# EasyEDA Pro project YanXi_Project.eprj, board PayloadBoard
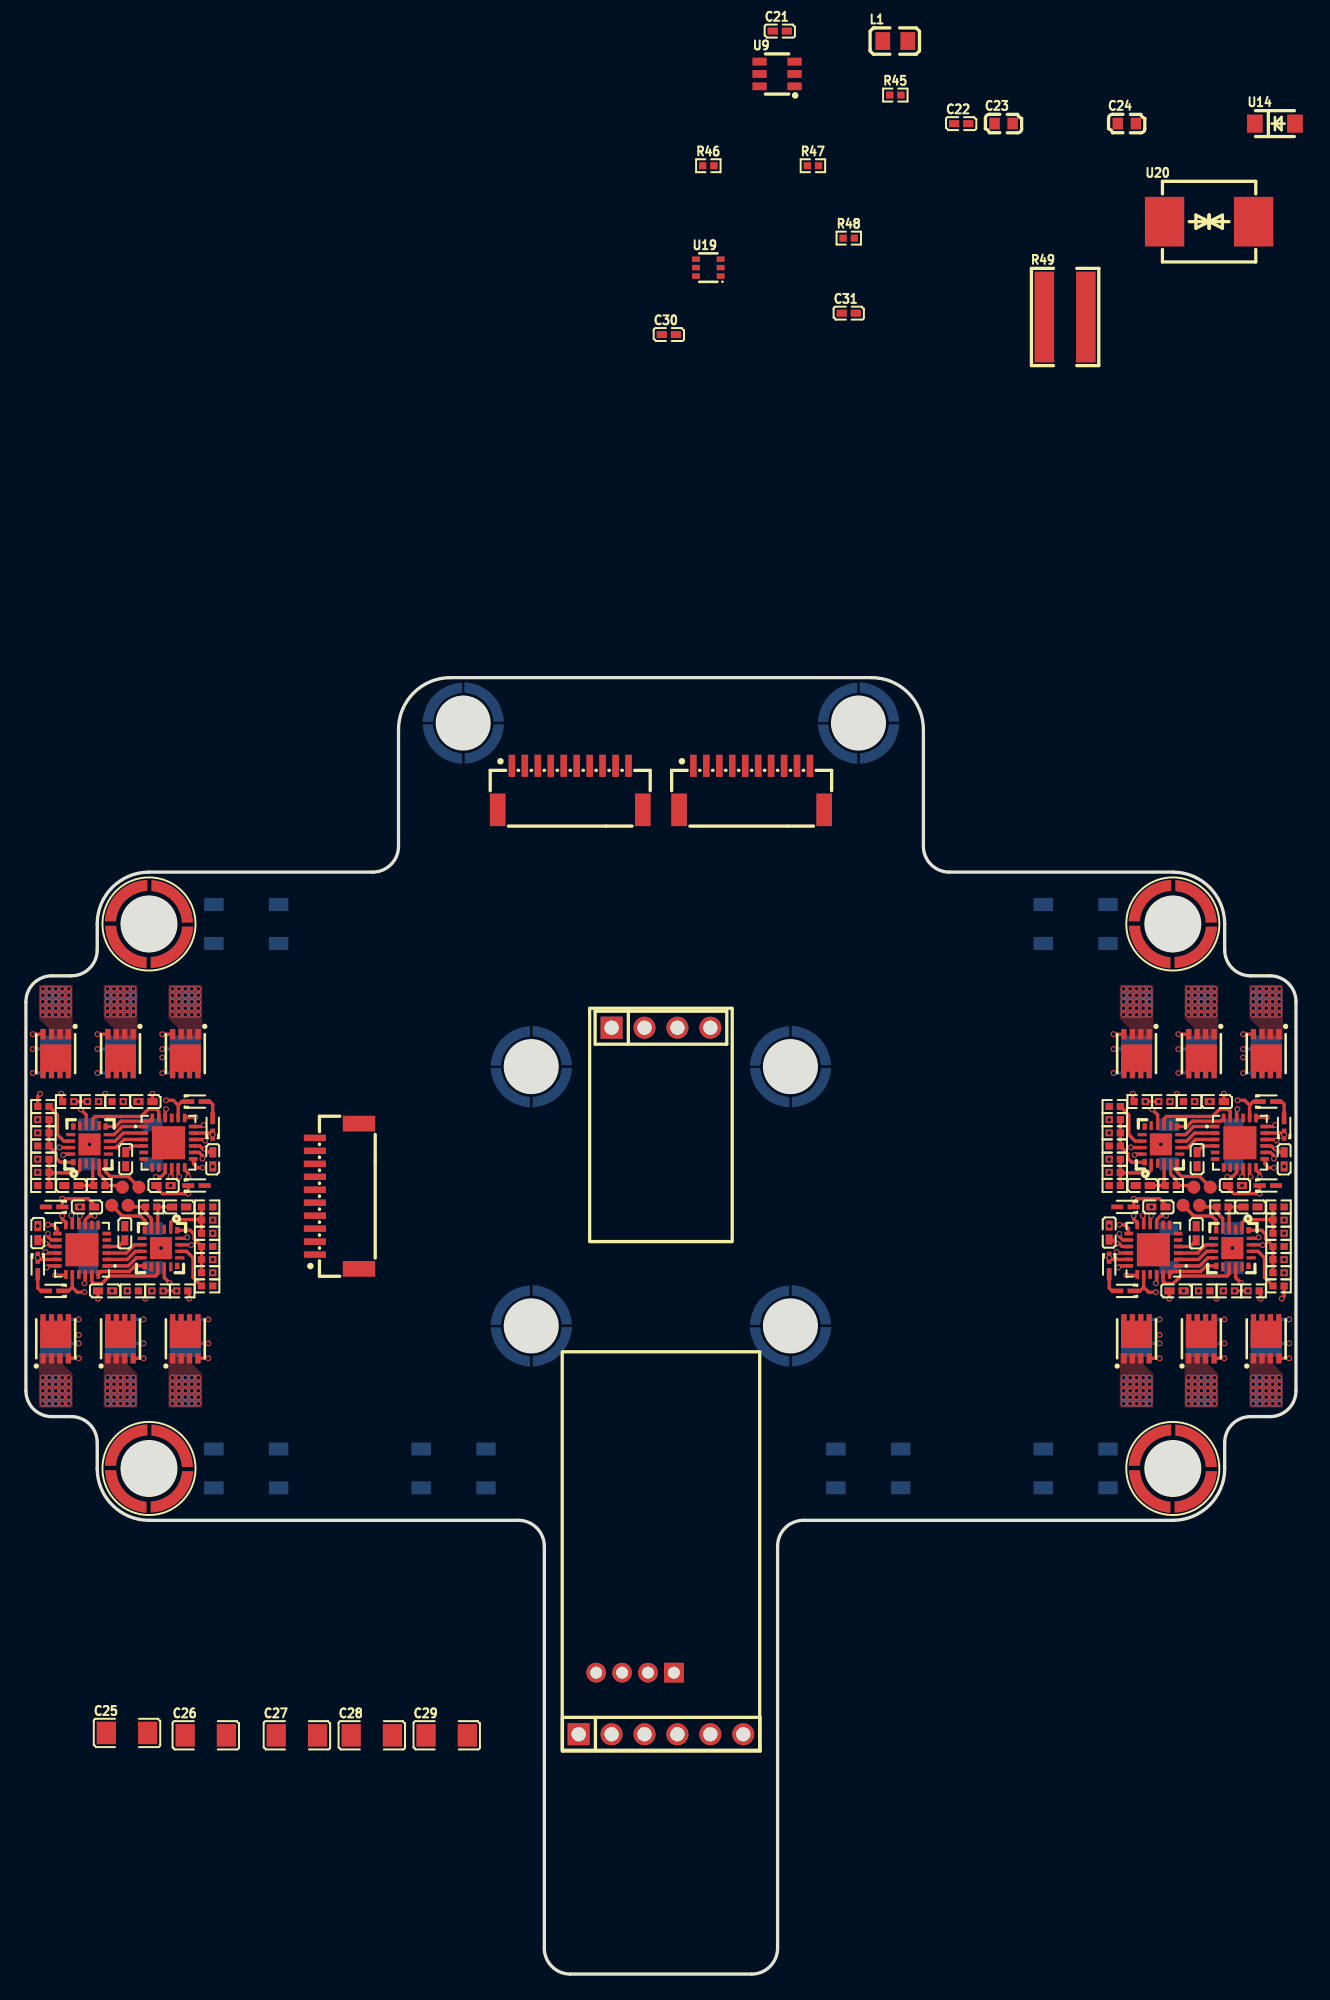
[diagram p5: board, top side]
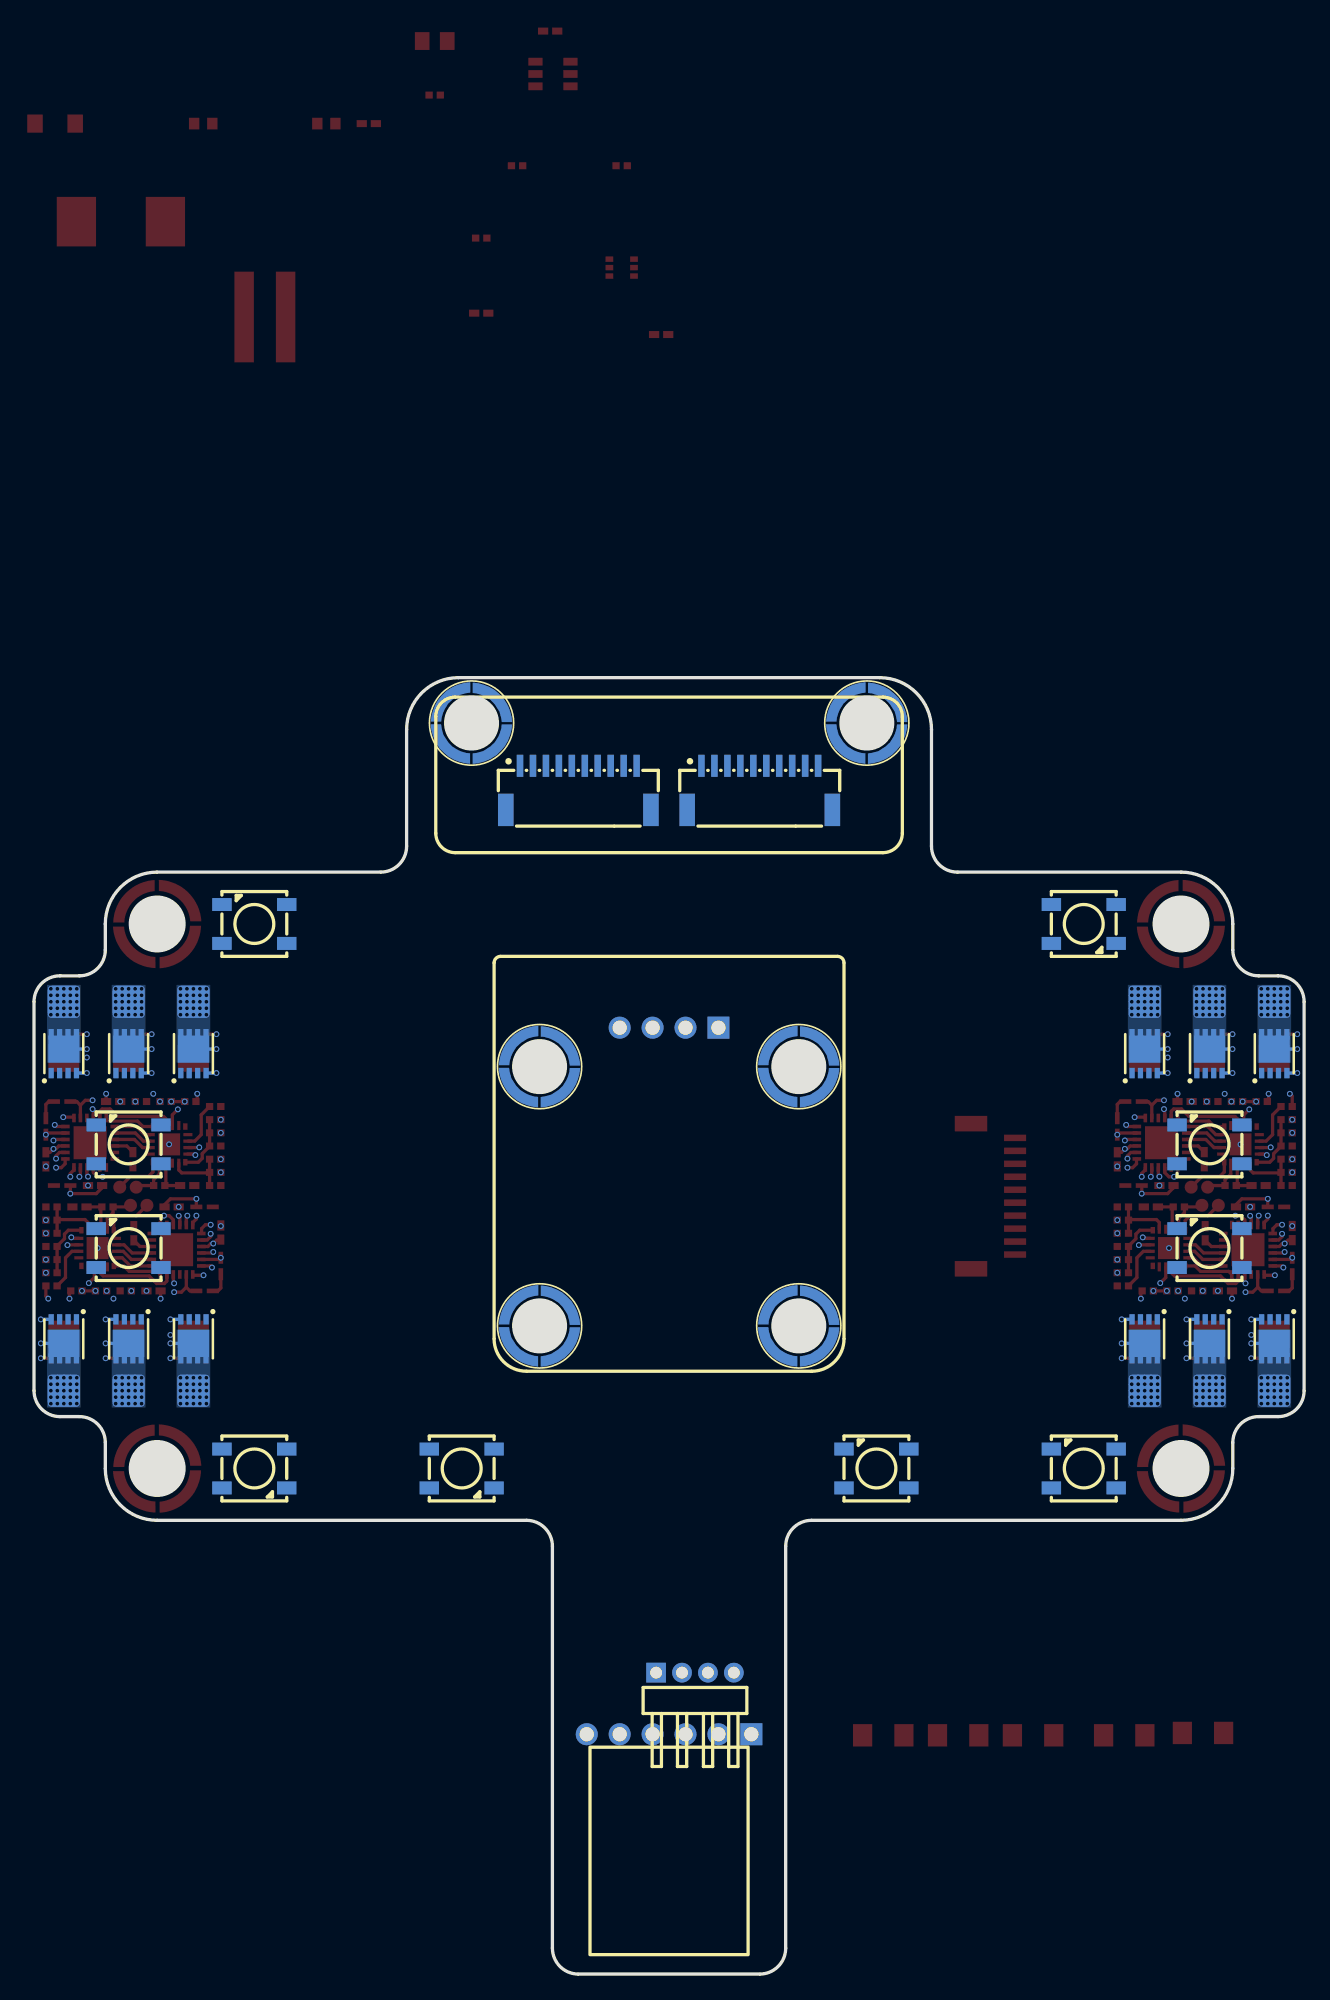
[diagram p6: board, bottom side, seen from below]

Outline 98 x 100 mm; copper layers: Top Layer, Inner1, Inner2, Bottom Layer. Coordinates in mm from the lower left corner of the outline.
Outline path: 0,75 0,45 arc(0.59,43.59) 2,43 3.5,43 arc(4.91,42.41) 5.5,41 5.5,39 arc(6.67,36.17) 9.5,35 38,35 arc(39.41,34.41) 40,33 40,2 arc(40.59,0.59) 42,0 56,0 arc(57.41,0.59) 58,2 58,33 arc(58.59,34.41) 60,35 88.5,35 arc(91.33,36.17) 92.5,39 92.5,41 arc(93.09,42.41) 94.5,43 96,43 arc(97.41,43.59) 98,45 98,75 arc(97.41,76.41) 96,77 94.5,77 arc(93.09,77.59) 92.5,79 92.5,81 arc(91.33,83.83) 88.5,85 71.25,85 arc(69.84,85.59) 69.25,87 69.25,96 arc(68.08,98.83) 65.25,100 32.75,100 arc(29.92,98.83) 28.75,96 28.75,87 arc(28.16,85.59) 26.75,85 9.5,85 arc(6.67,83.83) 5.5,81 5.5,79 arc(4.91,77.59) 3.5,77 2,77 arc(0.59,76.41) 0,75
Stack: Top Layer 0.035mm / Dielectric1 0.48mm PP er 4.5 / Inner1 0.035mm / Dielectric2 0.48mm FR4 er 4.5 / Inner2 0.035mm / Dielectric3 0.48mm PP er 4.5 / Bottom Layer 0.035mm

## Design rules (mm)
template: 自定义配置
spacing copperThickness1oz (default): track to track 0.102, other pairs 0.152 to 0.3
spacing copperThickness2oz: track to track 0.203, other pairs 0.152 to 0.3
spacing copperThicknessInner0.5oz: track to track 0.089, other pairs 0.152 to 0.3
track width copperThickness1oz (default): min 0.102, default 0.254, max 2.54
track width copperThickness2oz: min 0.203, default 0.254, max 2.54
track width copperThickness0.5oz: min 0.089, default 0.254, max 2.54
differential pair differentialPair (default): width min 0.127, default 0.254, max 2.54; gap min 0.152, default 0.152
via viaSize (default): diameter min 0.3, default 0.45, max 10; hole min 0.2, default 0.3, max 6.3

## Placement (name value [footprint] x y rotation side)
C1  1uF  [C0402]  91.89 67.3 180 top
C2  1uF  [C0402]  97.09 62.84 270 top
C3  100nF  [C0402_NEW]  86.18 60.83 180 top
C4  100nF  [C0402_NEW]  90.37 62.86 90 top
C5  1uF  [C0402]  93.29 60.83 180 top
C6  1uF  [C0402]  6.11 52.7 0 top
C7  1uF  [C0402]  0.92 57.16 90 top
C8  100nF  [C0402_NEW]  11.82 59.17 0 top
C9  100nF  [C0402_NEW]  7.63 57.14 270 top
C10  1uF  [C0402]  4.71 59.17 0 top
C11  1uF  [C0402]  9.22 67.3 180 top
C12  1uF  [C0402]  14.41 62.84 270 top
C13  100nF  [C0402_NEW]  3.51 60.83 180 top
C14  100nF  [C0402_NEW]  7.7 62.86 90 top
C15  1uF  [C0402]  10.62 60.83 180 top
C16  1uF  [C0402]  88.78 52.7 0 top
C17  1uF  [C0402]  83.59 57.2 90 top
C18  100nF  [C0402_NEW]  94.49 59.17 0 top
C19  100nF  [C0402_NEW]  90.3 57.14 270 top
C20  1uF  [C0402]  87.38 59.17 0 top
C21  100nF  [C0402_NEW]  58.17 149.88 0 top
C22  100nF  [C0402_NEW]  72.16 142.74 0 top
C23  4.7uF  [C0603]  75.44 142.74 0 top
C24  10uF  [C0603]  84.95 142.74 0 top
C25  10uF  [C1206]  7.8 18.6 0 top
C26  10uF  [C1206]  13.88 18.42 0 top
C27  10uF  [C1206]  20.91 18.42 0 top
C28  10uF  [C1206]  26.69 18.42 0 top
C29  10uF  [C1206]  32.47 18.42 0 top
C30  100nF  [C0402_NEW]  49.61 126.47 0 top
C31  1nF  [C0402]  63.49 128.12 0 top
D1  1N4148WT T4  [SOD-523_L1.2-W0.8-LS1.6-RD]  95.83 67.3 0 top
D2  1N4148WT T4  [SOD-523_L1.2-W0.8-LS1.6-RD]  97.09 65.38 90 top
D3  1N4148WT T4  [SOD-523_L1.2-W0.8-LS1.6-RD]  95.83 60.83 0 top
D4  1N4148WT T4  [SOD-523_L1.2-W0.8-LS1.6-RD]  2.17 52.7 180 top
D5  1N4148WT T4  [SOD-523_L1.2-W0.8-LS1.6-RD]  0.92 54.62 270 top
D6  1N4148WT T4  [SOD-523_L1.2-W0.8-LS1.6-RD]  2.17 59.17 180 top
D7  1N4148WT T4  [SOD-523_L1.2-W0.8-LS1.6-RD]  13.16 67.3 0 top
D8  1N4148WT T4  [SOD-523_L1.2-W0.8-LS1.6-RD]  14.41 65.38 90 top
D9  1N4148WT T4  [SOD-523_L1.2-W0.8-LS1.6-RD]  13.16 60.83 0 top
D10  1N4148WT T4  [SOD-523_L1.2-W0.8-LS1.6-RD]  84.84 52.7 180 top
D11  1N4148WT T4  [SOD-523_L1.2-W0.8-LS1.6-RD]  83.59 54.62 270 top
D12  1N4148WT T4  [SOD-523_L1.2-W0.8-LS1.6-RD]  84.84 59.17 180 top
D13  -  [端口]  95.7 75 180 bottom
D14  -  [端口]  90.7 75 180 bottom
D15  -  [端口]  85.7 75 180 bottom
D16  -  [端口]  12.3 75 180 bottom
D17  -  [端口]  7.3 75 180 bottom
D18  -  [端口]  2.3 75 180 bottom
D19  -  [端口]  2.3 45 180 bottom
D20  -  [端口]  7.3 45 180 bottom
D21  -  [端口]  12.3 45 180 bottom
D22  -  [端口]  85.7 45 180 bottom
D23  -  [端口]  90.7 45 180 bottom
D24  -  [端口]  95.7 45 180 bottom
H1  PZ254V-11-04P  [HDR-TH_4P-P2.54-V-M]  49 73 0 top
H2  PZ200-1-04-W  [HDR-TH_4P-P2.00-H-M-W7.2-N]  47 23.25 180 bottom
H3  PZ254V-11-06P  [HDR-TH_6P-P2.54-V-M]  49 18.5 0 top
L1  6.8uH  [L0805]  67.08 149.1 0 top
LED1  XL-5050RGBC-WS2812B  [LED-SMD_4P-L5.0-W5.0-BL_XL-5050RGBC]  17 81 270 bottom
LED2  XL-5050RGBC-WS2812B  [LED-SMD_4P-L5.0-W5.0-BL_XL-5050RGBC]  7.3 64 90 bottom
LED3  XL-5050RGBC-WS2812B  [LED-SMD_4P-L5.0-W5.0-BL_XL-5050RGBC]  7.3 56 90 bottom
LED4  XL-5050RGBC-WS2812B  [LED-SMD_4P-L5.0-W5.0-BL_XL-5050RGBC]  17 39 90 bottom
LED5  XL-5050RGBC-WS2812B  [LED-SMD_4P-L5.0-W5.0-BL_XL-5050RGBC]  33 39 90 bottom
LED6  XL-5050RGBC-WS2812B  [LED-SMD_4P-L5.0-W5.0-BL_XL-5050RGBC]  65 39 270 bottom
LED7  XL-5050RGBC-WS2812B  [LED-SMD_4P-L5.0-W5.0-BL_XL-5050RGBC]  81 39 270 bottom
LED8  XL-5050RGBC-WS2812B  [LED-SMD_4P-L5.0-W5.0-BL_XL-5050RGBC]  90.7 56 90 bottom
LED9  XL-5050RGBC-WS2812B  [LED-SMD_4P-L5.0-W5.0-BL_XL-5050RGBC]  90.7 64 90 bottom
LED10  XL-5050RGBC-WS2812B  [LED-SMD_4P-L5.0-W5.0-BL_XL-5050RGBC]  81 81 90 bottom
Q1  AON7544  [DFN-8_L3.0-W3.0-P0.65-BL]  95.7 71 180 top
Q2  AON7544  [DFN-8_L3.0-W3.0-P0.65-BL]  90.7 71 180 top
Q3  AON7544  [DFN-8_L3.0-W3.0-P0.65-BL]  85.7 71 180 top
Q4  AON7544  [DFN-8_L3.0-W3.0-P0.65-BL]  12.3 71 180 top
Q5  AON7544  [DFN-8_L3.0-W3.0-P0.65-BL]  7.3 71 180 top
Q6  AON7544  [DFN-8_L3.0-W3.0-P0.65-BL]  2.3 71 180 top
Q7  AON7544  [DFN-8_L3.0-W3.0-P0.65-BL]  95.7 71 180 bottom
Q8  AON7544  [DFN-8_L3.0-W3.0-P0.65-BL]  90.7 71 180 bottom
Q9  AON7544  [DFN-8_L3.0-W3.0-P0.65-BL]  85.7 71 180 bottom
Q10  AON7544  [DFN-8_L3.0-W3.0-P0.65-BL]  12.3 71 180 bottom
Q11  AON7544  [DFN-8_L3.0-W3.0-P0.65-BL]  7.3 71 180 bottom
Q12  AON7544  [DFN-8_L3.0-W3.0-P0.65-BL]  2.3 71 180 bottom
Q13  AON7544  [DFN-8_L3.0-W3.0-P0.65-BL]  2.3 49 0 top
Q14  AON7544  [DFN-8_L3.0-W3.0-P0.65-BL]  7.3 49 0 top
Q15  AON7544  [DFN-8_L3.0-W3.0-P0.65-BL]  12.3 49 0 top
Q16  AON7544  [DFN-8_L3.0-W3.0-P0.65-BL]  85.7 49 0 top
Q17  AON7544  [DFN-8_L3.0-W3.0-P0.65-BL]  90.7 49 0 top
Q18  AON7544  [DFN-8_L3.0-W3.0-P0.65-BL]  95.7 49 0 top
Q19  AON7544  [DFN-8_L3.0-W3.0-P0.65-BL]  2.3 49 0 bottom
Q20  AON7544  [DFN-8_L3.0-W3.0-P0.65-BL]  7.3 49 0 bottom
Q21  AON7544  [DFN-8_L3.0-W3.0-P0.65-BL]  12.3 49 0 bottom
Q22  AON7544  [DFN-8_L3.0-W3.0-P0.65-BL]  85.7 49 0 bottom
Q23  AON7544  [DFN-8_L3.0-W3.0-P0.65-BL]  90.7 49 0 bottom
Q24  AON7544  [DFN-8_L3.0-W3.0-P0.65-BL]  95.7 49 0 bottom
R1  10K  [R0402]  84.02 66.92 180 top
R2  47K  [R0402]  84.02 62.86 180 top
R3  47K  [R0402]  85.94 67.3 180 top
R4  47K  [R0402]  84.02 65.91 180 top
R5  10K  [R0402]  84.02 61.84 0 top
R6  10K  [R0402]  87.84 67.3 180 top
R7  1K  [R0402]  88.34 60.83 0 top
R8  10K  [R0402]  84.02 64.89 0 top
R9  4.7K  [R0402]  84.02 60.83 0 top
R10  4.7K  [R0402]  89.75 67.3 0 top
R11  4.7K  [R0402]  84.02 63.87 0 top
R12  10K  [R0402]  13.98 53.08 0 top
R13  47K  [R0402]  13.98 57.14 0 top
R14  47K  [R0402]  12.06 52.7 0 top
R15  47K  [R0402]  13.98 54.09 0 top
R16  10K  [R0402]  13.98 58.16 180 top
R17  10K  [R0402]  10.16 52.7 0 top
R18  1K  [R0402]  9.66 59.17 180 top
R19  10K  [R0402]  13.98 55.11 180 top
R20  4.7K  [R0402]  13.98 59.17 180 top
R21  4.7K  [R0402]  8.25 52.7 180 top
R22  4.7K  [R0402]  13.98 56.13 180 top
R23  10K  [R0402]  1.35 66.92 180 top
R24  47K  [R0402]  1.35 62.86 180 top
R25  47K  [R0402]  3.27 67.3 180 top
R26  47K  [R0402]  1.35 65.91 180 top
R27  10K  [R0402]  1.35 61.84 0 top
R28  10K  [R0402]  5.17 67.3 180 top
R29  1K  [R0402]  5.67 60.83 0 top
R30  10K  [R0402]  1.35 64.89 0 top
R31  4.7K  [R0402]  1.35 60.83 0 top
R32  4.7K  [R0402]  7.08 67.3 0 top
R33  4.7K  [R0402]  1.35 63.87 0 top
R34  10K  [R0402]  96.65 53.08 0 top
R35  47K  [R0402]  96.65 57.14 0 top
R36  47K  [R0402]  94.73 52.7 0 top
R37  47K  [R0402]  96.65 54.09 0 top
R38  10K  [R0402]  96.65 58.16 180 top
R39  10K  [R0402]  92.83 52.7 0 top
R40  1K  [R0402]  92.33 59.17 180 top
R41  10K  [R0402]  96.65 55.11 180 top
R42  4.7K  [R0402]  96.65 59.17 180 top
R43  4.7K  [R0402]  90.92 52.7 180 top
R44  4.7K  [R0402]  96.65 56.13 180 top
R45  100kΩ  [R0402]  67.08 144.94 0 top
R46  10K  [R0402]  52.66 139.49 0 top
R47  90.9kΩ  [R0402]  60.73 139.49 0 top
R48  56Ω  [R0402]  63.49 133.9 0 top
R49  10mΩ  [R1225]  80.19 127.82 0 top
U1  EFM8BB21F16G-C-QFN20R  [QFN-20_L3.0-W3.0-P0.50-BL-EP1.7_EFM8BB21F16G]  87.58 64 0 top
U2  FD6288Q  [QFN-24_L4.0-W4.0-P0.50-BL-EP2.6]  93.67 64.13 270 top
U3  EFM8BB21F16G-C-QFN20R  [QFN-20_L3.0-W3.0-P0.50-BL-EP1.7_EFM8BB21F16G]  10.42 56 180 top
U4  FD6288Q  [QFN-24_L4.0-W4.0-P0.50-BL-EP2.6]  4.33 55.87 90 top
U5  EFM8BB21F16G-C-QFN20R  [QFN-20_L3.0-W3.0-P0.50-BL-EP1.7_EFM8BB21F16G]  4.91 64 0 top
U6  FD6288Q  [QFN-24_L4.0-W4.0-P0.50-BL-EP2.6]  11 64.13 270 top
U7  EFM8BB21F16G-C-QFN20R  [QFN-20_L3.0-W3.0-P0.50-BL-EP1.7_EFM8BB21F16G]  93.09 56 180 top
U8  FD6288Q  [QFN-24_L4.0-W4.0-P0.50-BL-EP2.6]  87 55.87 90 top
U9  JW5026  [SOT-23-6_L2.9-W1.6-P0.95-LS2.8-BR]  57.96 146.56 0 top
U10  -  [烧录点]  90.12 60.7 0 top
U11  -  [烧录点]  7.89 59.3 180 top
U12  -  [烧录点]  7.44 60.7 0 top
U13  -  [烧录点]  90.56 59.3 0 top
U14  SMF8.0A  [SOD-123FL_L2.8-W1.8-LS3.6-RD]  96.38 142.74 0 top
U15  -  [烧录点]  91.38 60.7 0 top
U16  -  [烧录点]  6.61 59.3 180 top
U17  -  [烧录点]  8.71 60.7 0 top
U18  -  [烧录点]  89.29 59.3 0 top
U19  INA199A1DCKR  [SC-70-6_L2.2-W1.3-P0.65-LS2.1-BR]  52.66 131.63 0 top
U20  SMDJ28CA  [SMC_L6.9-W5.9-LS7.9-BI]  91.3 135.17 0 top
U21  SMTSO3050CTJ  [SMD_SMTSO3060CTJ]  9.5 81 0 top
U22  SMTSO3050CTJ  [SMD_SMTSO3060CTJ]  88.5 81 0 top
U23  SMTSO3050CTJ  [SMD_SMTSO3060CTJ]  9.5 39 0 top
U24  SMTSO3050CTJ  [SMD_SMTSO3060CTJ]  88.5 39 0 top
U25  WAFER-SH1.0-10PWB  [CONN-SMD_10P-P1.00_WAFER-SH1.0-10PWB]  42 91.5 0 top
U26  WAFER-SH1.0-10PWB  [CONN-SMD_10P-P1.00_WAFER-SH1.0-10PWB]  56 91.5 0 top
U27  WAFER-SH1.0-10PWB  [CONN-SMD_10P-P1.00_WAFER-SH1.0-10PWB]  24 60 90 top
U28  SMTSO3015CTJ  [SMD_BD5.6-L5.6-W5.6-D4.1]  59 50 180 bottom
U29  SMTSO3015CTJ  [SMD_BD5.6-L5.6-W5.6-D4.1]  39 50 180 bottom
U30  SMTSO3015CTJ  [SMD_BD5.6-L5.6-W5.6-D4.1]  59 70 180 bottom
U31  SMTSO3015CTJ  [SMD_BD5.6-L5.6-W5.6-D4.1]  39 70 180 bottom
U32  SMTSO3015CTJ  [SMD_BD5.6-L5.6-W5.6-D4.1]  64.25 96.5 180 bottom
U33  SMTSO3015CTJ  [SMD_BD5.6-L5.6-W5.6-D4.1]  33.75 96.5 180 bottom
U34  WAFER-SH1.0-10PWB  [CONN-SMD_10P-P1.00_WAFER-SH1.0-10PWB]  42 91.5 180 bottom
U35  WAFER-SH1.0-10PWB  [CONN-SMD_10P-P1.00_WAFER-SH1.0-10PWB]  56 91.5 180 bottom

## Footprints (pads in the part's own frame, mm; a bottom-side part is the same pattern mirrored in y, then rotated)
C0402
  rect 0.79x0.54 smd: 1(-0.545,0) 2(0.545,0)
C0402_NEW
  rect 0.79x0.54 smd: 1(-0.545,0) 2(0.545,0)
C0603
  rect 0.8x0.9 smd: 1(-0.7,0) 2(0.7,0)
C1206
  rect 1.485x1.728 smd: 1(-1.593,0) 2(1.593,0)
CONN-SMD_10P-P1.00_WAFER-SH1.0-10PWB
  rect 0.5x1.7 smd: 1(-4.5,1.7) 2(-3.5,1.7) 3(-2.5,1.7) 4(-1.5,1.7) 5(-0.5,1.7) 6(0.5,1.7) 7(1.5,1.7) 8(2.5,1.7) 9(3.5,1.7) 10(4.5,1.7)
  rect 1.2x2.5 smd: 11(5.6,-1.7) 12(-5.6,-1.7)
DFN-8_L3.0-W3.0-P0.65-BL
  rect 0.4x0.8 smd: 1(-0.975,-1.5) 2(-0.325,-1.5) 3(0.325,-1.5) 4(0.975,-1.5) 5(0.975,1.5) 6(0.325,1.5) 7(-0.325,1.5) 8(-0.975,1.5)
  rect 2.4x2.1 smd: 9(0,0.35)
HDR-TH_4P-P2.00-H-M-W7.2-N
  rect 1.524x1.524 hole 0.914: 1(-3,0)
  round 1.524 hole 0.914: 2(-1,0) 3(1,0) 4(3,0)
HDR-TH_4P-P2.54-V-M
  rect 1.7x1.7 hole 1.1: 1(-3.81,0)
  round 1.7 hole 1.1: 2(-1.27,0) 3(1.27,0) 4(3.81,0)
HDR-TH_6P-P2.54-V-M
  rect 1.7x1.7 hole 1.1: 1(-6.35,0)
  round 1.7 hole 1.1: 2(-3.81,0) 3(-1.27,0) 4(1.27,0) 5(3.81,0) 6(6.35,0)
L0805
  rect 1.133x1.377 smd: 1(-0.966,0) 2(0.966,0)
LED-SMD_4P-L5.0-W5.0-BL_XL-5050RGBC
  rect 1x1.5 smd: 1(-1.5,-2.5) 2(1.5,-2.5) 3(1.5,2.5) 4(-1.5,2.5)
QFN-20_L3.0-W3.0-P0.50-BL-EP1.7_EFM8BB21F16G
  rect 0.34x0.5 smd: 1(-1.252,-1.377) 6(1.248,-1.377) 11(1.248,1.377) 16(-1.252,1.377)
  rect 0.25x0.7 smd: 2(-0.751,-1.45) 3(-0.252,-1.45) 4(0.248,-1.45) 5(0.749,-1.45) 12(0.749,1.45) 13(0.248,1.45) 14(-0.252,1.45) 15(-0.751,1.45)
  rect 0.7x0.25 smd: 7(1.452,-0.75) 8(1.452,-0.25) 9(1.452,0.25) 10(1.452,0.75) 17(-1.452,0.75) 18(-1.452,0.25) 19(-1.452,-0.25) 20(-1.452,-0.75)
  rect 1.7x1.7 smd: 21(-0.002,0)
QFN-24_L4.0-W4.0-P0.50-BL-EP2.6
  rect 0.28x0.665 smd: 1(-1.25,-1.907) 2(-0.75,-1.907) 3(-0.25,-1.907) 4(0.25,-1.907) 5(0.75,-1.907) 6(1.25,-1.907) 13(1.25,1.907) 14(0.75,1.907) 15(0.25,1.907) 16(-0.25,1.907) 17(-0.75,1.907) 18(-1.25,1.907)
  rect 0.665x0.28 smd: 7(1.907,-1.25) 8(1.907,-0.75) 9(1.907,-0.25) 10(1.907,0.25) 11(1.907,0.75) 12(1.907,1.25) 19(-1.907,1.25) 20(-1.907,0.75) 21(-1.907,0.25) 22(-1.907,-0.25) 23(-1.907,-0.75) 24(-1.907,-1.25)
  rect 2.55x2.55 smd: 25(0,0)
R0402
  rect 0.566x0.54 smd: 1(-0.433,0) 2(0.433,0)
R1225
  rect 1.5x7 smd: 1(-1.6,0) 2(1.6,0)
SC-70-6_L2.2-W1.3-P0.65-LS2.1-BR
  rect 0.6x0.42 smd: 1(0.95,-0.65) 2(0.95,0) 3(0.95,0.65) 4(-0.95,0.65) 5(-0.95,0) 6(-0.95,-0.65)
SMC_L6.9-W5.9-LS7.9-BI
  rect 3.03x3.82 smd: 1(-3.435,0) 2(3.435,0)
SMD_BD5.6-L5.6-W5.6-D4.1
  custom 3.04x3.04 smd: 1(1.623,2.141) 2(1.617,-2.171) 3(-1.623,-2.167) 4(-1.609,2.171)
SMD_SMTSO3060CTJ
  custom 3.197x3.278 smd: 1(1.79,2.34)
  custom 3.279x3.197 smd: 2(1.768,-2.386) 4(-1.769,2.386)
  custom 3.197x3.279 smd: 3(-1.79,-2.369)
SOD-123FL_L2.8-W1.8-LS3.6-RD
  rect 1.2x1.4 smd: 1(-1.55,0) 2(1.55,0)
SOD-523_L1.2-W0.8-LS1.6-RD
  rect 0.93x0.36 smd: 1(-0.635,0) 2(0.635,0)
SOT-23-6_L2.9-W1.6-P0.95-LS2.8-BR
  rect 1.1x0.6 smd: 1(1.35,-0.95) 2(1.35,0) 3(1.35,0.95) 4(-1.35,0.95) 5(-1.35,0) 6(-1.35,-0.95)
烧录点
  round 1 smd: 1(0,0)
端口
  rrect 2.5x2.5 smd: 1(0,0)

## Nets
As in the schematic.

Pads without a net: H1 1 2 3 4; H2 1 2 3 4; H3 1 2 3 4 5 6; LED5 2; LED6 2; U1 7 15 16 17; U2 5 7 8 21; U3 7 15 16 17; U4 5 7 8 21; U5 7 15 16 17; U6 5 7 8 21; U7 7 15 16 17; U8 5 7 8 21; U21 2 3 4; U22 2 3 4; U23 2 3 4; U24 2 3 4; U25 11 12; U26 11 12; U27 11 12; U28 2 3 4; U29 2 3 4; U30 2 3 4; U31 2 3 4; U32 2 3 4; U33 2 3 4; U34 11 12; U35 11 12

## Via types
v1: diameter 0.45, hole 0.3, Top Layer to Bottom Layer, 470 vias

## Routing (per net, layer and track width the routed paths; a pad name or vN(x,y) marks a point on that pad's centre or on a via; arc(x,y) is an arc through that point)
3.3V: length 11.8
  Top Layer w0.254: U3.4 10.17,59.1 R18.1 C8.1 ; U5.4 5.16,60.9 R29.1 C13.1 ; U7.4 92.84,59.1 R40.1 C18.1 ; 86.72,60.83 R7.1 87.83,60.9 U1.4
8V: length 13.5
  Top Layer w0.254: C4.2 90.84,63.88 U2.4 ; D2.2 97.09,67.08 96.87,67.3 D1.2 ; D7.2 14.19,67.3 14.41,67.08 D8.2 ; U8.4 89.83,56.12 C19.2 ; C14.2 8.17,63.88 U6.4 ; D10.2 83.81,52.7 83.59,52.92 D11.2 ; D4.2 1.14,52.7 0.92,52.92 D5.2 ; U4.4 7.16,56.12 C9.2
GND:
  vias: v1(4.91,64) v1(10.42,56) v1(87.58,64) v1(93.09,56)
M1_AIN: length 5
  Top Layer w0.254: U1.2 86.83,62.02 86.6,61.8 84.49,61.8 R5.2 ; R5.2 R2.1 ; R5.2 R9.2
M1_BIN: length 9.3
  Top Layer w0.254: v1(85.55,63.17) 85.62,63.25 U1.20 ; v1(87.41,67.3) v1(86.37,67.3)
  Inner1 w0.254: v1(87.41,67.3) 87.56,67.3 88.07,66.8 88.49,66.8 88.99,67.3 v1(90.18,67.3) ; v1(85.55,63.17) 86.37,64 v1(86.37,67.3)
M1_C: length 13.2
  Top Layer w0.254: v1(85.25,63.77) 85.27,63.75 U1.19
  Inner1 w0.254: v1(83.59,61.84) 83.08,62.34 83.08,64.39 v1(83.59,64.89) 84.71,63.77 v1(85.25,63.77) 85.25,66.95 86.11,67.81 87.77,67.81 v1(88.28,67.3)
M1_C2CK: length 3.3
  Top Layer w0.254: U10.1 89.99,60.83 R7.2 88.77,61.27 88.33,61.72 U1.5
M1_C2D: length 3.8
  Top Layer w0.254: U1.6 88.83,61.87 89.17,61.52 90.56,61.52 U15.1
M1_CIN: length 4.6
  Top Layer w0.254: U1.1 85.32,62.62 85.02,62.92 85.02,63.28 84.45,63.85 R8.2 R4.1
M1_HIN1: length 9
  Top Layer w0.254: U2.22 93.42,66.66 v1(93.48,66.72) ; v1(86.9,66.7) 87.33,66.27 U1.14
  Inner1 w0.254: v1(86.9,66.7) 87.2,66.4 93.16,66.4 v1(93.48,66.72)
M1_HIN2: length 6.5
  Top Layer w0.254: U1.13 87.83,65.98 88,66.15 91.56,66.15 92.13,66.73 92.73,66.73 92.92,66.54 U2.23
M1_HIN3: length 3.9
  Top Layer w0.254: U1.11 89.6,65.38 90.01,65.8 92.18,65.8 U2.24
M1_HO1: length 9.4
  Top Layer w0.254: v1(93.93,72.5) Q1.4 ; v1(95.75,66.1) 94.98,66.1 U2.19
  Inner2 w0.254: v1(93.93,72.5) 93.93,72.06 94.39,71.6 95.4,71.6 95.75,71.25 v1(95.75,66.1)
M1_HO2: length 16.4
  Top Layer w0.254: v1(96.5,64.3) 96.42,64.38 U2.16 ; v1(88.93,72.5) Q2.4
  Inner2 w0.254: v1(96.5,64.3) 95.5,64.3 95.24,64.55 95.24,68.26 94.7,68.8 90.1,68.8 89.7,69.2 89.7,71.29 88.93,72.06 v1(88.93,72.5)
M1_HO3: length 23.7
  Top Layer w0.254: U2.13 95.6,62.86 95.6,62.5 95.9,62.2 v1(96.3,62.2) ; v1(83.93,72.5) Q3.4
  Inner2 w0.254: v1(83.92,72.5) 83.92,72.06 84.6,71.39 84.6,68.8 84.96,68.44 94.55,68.44 94.89,68.11 94.89,62.56 95.25,62.2 v1(96.3,62.2)
M1_LIN1: length 3
  Top Layer w0.254: U2.1 90.1,65.38 89.48,64.75 U1.10
M1_LIN2: length 3
  Top Layer w0.254: U2.2 90.18,64.88 89.56,64.25 U1.9
M1_LIN3: length 3
  Top Layer w0.254: U1.8 89.62,63.75 90.25,64.38 U2.3
M1_LO1: length 9.8
  Top Layer w0.254: v1(94.5,61.5) 94.42,61.58 U2.11
  Inner1 w0.254: v1(93.93,69.5) 94.5,68.92 v1(94.5,61.5)
  Bottom Layer w0.254: v1(93.93,69.5) Q7.4
M1_LO2: length 14.2
  Top Layer w0.254: U2.10 93.92,61.6 v1(93.84,61.51)
  Inner1 w0.254: v1(88.8,67.9) 88.8,69.38 v1(88.93,69.5)
  Inner2 w0.254: v1(88.8,67.9) 88.8,62.9 89.2,62.5 93.5,62.5 93.84,62.17 v1(93.84,61.51)
  Bottom Layer w0.254: v1(88.93,69.5) Q8.4
M1_LO3: length 18.3
  Top Layer w0.254: U2.9 93.42,61.82 93.1,61.5 v1(92.7,61.5)
  Inner2 w0.254: v1(83.93,69.5) 83.9,69.47 83.9,68.7 84.3,68.3 84.3,62 84.8,61.5 v1(92.7,61.5)
  Bottom Layer w0.254: v1(83.93,69.5) Q9.4
M1_VB1: length 5.1
  Top Layer w0.254: v1(93.48,67.4) 94.04,67.4 94.42,67.02 ; 94.42,67.02 U2.20 ; 94.42,67.02 94.7,67.3 D1.1
  Inner1 w0.254: v1(91.35,67.3) 93.38,67.3 v1(93.48,67.4)
M1_VB2: length 4
  Top Layer w0.254: v1(97.09,64.75) 96.96,64.88 U2.17
  Inner1 w0.254: v1(97.09,62.3) v1(97.09,64.75)
M1_VB3: length 7.7
  Top Layer w0.254: U2.14 96.04,63.38 96.3,63.11 v1(96.3,62.9) ; C5.2 92.75,60.66 93.2,60.2 v1(95.2,60.2) 95.19,60.2 D3.1
  Inner1 w0.254: v1(95.2,60.2) 95.8,60.8 95.8,62.5 96.2,62.9 v1(96.3,62.9)
M1_VS1: length 33.5
  Top Layer w0.254: U2.18 96.28,65.38 v1(96.4,65.5) ; C1.1 v1(92.44,67.9)
  Inner1 w0.254: v1(96.4,65.5) 96.4,70.97 96.03,71.35 v1(93.93,71.35) 92.82,71.35 92.44,70.96 v1(92.44,67.9) 92.54,68 93.8,68 94.14,67.66 94.14,62.94 93.8,62.6 83.84,62.6 v1(83.59,62.86)
  Bottom Layer w0.254: v1(93.93,71.35) Q7.9
  vias: v1(94.7,76) v1(94.7,75.5) v1(94.7,75) v1(94.7,74.5) v1(94.7,74) v1(95.2,76) v1(95.2,75.5) v1(95.2,75) v1(95.2,74.5) v1(95.2,74) v1(95.7,76) v1(95.7,75.5) v1(95.7,75) v1(95.7,74.5) v1(95.7,74) v1(96.2,76) v1(96.2,75.5) v1(96.2,75) v1(96.2,74.5) v1(96.2,74) v1(96.7,76) v1(96.7,75.5) v1(96.7,75) v1(96.7,74.5) v1(96.7,74)
M1_VS2: length 28.4
  Top Layer w0.254: C2.1 96.76,63.39 v1(96.5,63.65) 96.31,63.65 96.09,63.88 U2.15 ; R3.2 85.41,67.4 v1(85.41,67.9)
  Inner1 w0.254: v1(85.41,67.9) 85.41,68.2 85.8,68.6 87.8,68.6 88.1,68.9 88.1,71 88.45,71.35 v1(88.93,71.35) ; v1(96.5,63.65) 95.15,63.65 94.86,63.94 94.86,70.34 94.5,70.7 v1(93.93,70.7)
  Inner2 w0.254: v1(93.93,70.7) 90.8,70.7 89.43,72.07 89.43,72.71 89.13,73 88.72,73 88.42,72.71 88.42,71.55 88.62,71.35 v1(88.93,71.35)
  Bottom Layer w0.254: v1(88.93,71.35) Q8.9
  vias: v1(89.7,76) v1(89.7,75.5) v1(89.7,75) v1(89.7,74.5) v1(89.7,74) v1(90.2,76) v1(90.2,75.5) v1(90.2,75) v1(90.2,74.5) v1(90.2,74) v1(90.7,76) v1(90.7,75.5) v1(90.7,75) v1(90.7,74.5) v1(90.7,74) v1(91.2,76) v1(91.2,75.5) v1(91.2,75) v1(91.2,74.5) v1(91.2,74) v1(91.7,76) v1(91.7,75.5) v1(91.7,75) v1(91.7,74.5) v1(91.7,74)
M1_VS3: length 26.2
  Top Layer w0.254: U2.12 94.92,62.03 95.2,61.75 v1(95.2,61.5)
  Inner1 w0.254: v1(83.93,71.35) 83.57,71.35 83.23,71.02 83.23,66.26 v1(83.59,65.91) ; v1(95.2,61.5) 95.2,61.24 94.78,60.83 v1(93.84,60.83)
  Inner2 w0.254: v1(83.59,65.91) 83.08,65.4 83.08,61.33 83.54,60.87 93.79,60.87 v1(93.84,60.83)
  Bottom Layer w0.254: v1(83.93,71.35) Q9.9
  vias: v1(84.7,76) v1(84.7,75.5) v1(84.7,75) v1(84.7,74.5) v1(84.7,74) v1(85.2,76) v1(85.2,75.5) v1(85.2,75) v1(85.2,74.5) v1(85.2,74) v1(85.7,76) v1(85.7,75.5) v1(85.7,75) v1(85.7,74.5) v1(85.7,74) v1(86.2,76) v1(86.2,75.5) v1(86.2,75) v1(86.2,74.5) v1(86.2,74) v1(86.7,76) v1(86.7,75.5) v1(86.7,75) v1(86.7,74.5) v1(86.7,74)
M2_AIN: length 5
  Top Layer w0.254: U3.2 11.17,57.98 11.4,58.2 13.51,58.2 R16.2 ; R20.2 R16.2 ; R16.2 R13.1
M2_BIN: length 9.3
  Top Layer w0.254: U3.20 12.38,56.75 v1(12.45,56.83) ; v1(10.59,52.7) v1(11.63,52.7)
  Inner1 w0.254: v1(10.59,52.7) 10.44,52.7 9.93,53.2 9.51,53.2 9.01,52.7 v1(7.82,52.7) ; v1(12.45,56.83) 11.63,56 v1(11.63,52.7)
M2_C: length 13.2
  Top Layer w0.254: v1(12.75,56.23) 12.73,56.25 U3.19
  Inner1 w0.254: v1(9.72,52.7) 10.23,52.19 11.89,52.19 12.75,53.05 v1(12.75,56.23) 13.29,56.23 v1(14.41,55.11) 14.92,55.61 14.92,57.66 v1(14.41,58.16)
M2_C2CK: length 3.3
  Top Layer w0.254: U11.1 8.01,59.17 R18.2 9.23,58.73 9.67,58.28 U3.5
M2_C2D: length 3.8
  Top Layer w0.254: U16.1 7.44,58.48 8.83,58.48 9.17,58.13 U3.6
M2_CIN: length 4.6
  Top Layer w0.254: R15.1 R19.2 R22.2 13.55,56.15 12.98,56.72 12.98,57.08 12.68,57.38 U3.1
M2_HIN1: length 9
  Top Layer w0.254: U4.22 4.58,53.34 v1(4.52,53.28) ; v1(11.1,53.3) 10.67,53.73 U3.14
  Inner1 w0.254: v1(11.1,53.3) 10.8,53.6 4.84,53.6 v1(4.52,53.28)
M2_HIN2: length 6.5
  Top Layer w0.254: U3.13 10.17,54.02 10,53.85 6.44,53.85 5.87,53.27 5.27,53.27 5.08,53.46 U4.23
M2_HIN3: length 3.9
  Top Layer w0.254: U4.24 5.82,54.2 7.98,54.2 8.4,54.62 U3.11
M2_HO1: length 9.4
  Top Layer w0.254: v1(2.25,53.9) 3.02,53.9 U4.19 ; v1(4.08,47.5) 3.28,47.5
  Inner2 w0.254: v1(2.25,53.9) 2.25,48.75 2.6,48.4 3.61,48.4 4.08,47.94 v1(4.08,47.5)
M2_HO2: length 16.4
  Top Layer w0.254: U4.16 1.58,55.62 v1(1.5,55.7) ; v1(9.08,47.5) 8.28,47.5
  Inner2 w0.254: v1(9.08,47.5) 9.08,47.94 8.3,48.71 8.3,50.8 7.9,51.2 3.3,51.2 2.76,51.74 2.76,55.45 2.5,55.7 v1(1.5,55.7)
M2_HO3: length 23.7
  Top Layer w0.254: v1(1.7,57.8) 2.1,57.8 2.4,57.5 2.4,57.14 U4.13 ; v1(14.08,47.5) 13.28,47.5
  Inner2 w0.254: v1(14.08,47.5) 14.08,47.94 13.4,48.61 13.4,51.2 13.04,51.56 3.45,51.56 3.11,51.89 3.11,57.44 2.75,57.8 v1(1.7,57.8)
M2_LIN1: length 3
  Top Layer w0.254: U4.1 7.9,54.62 8.52,55.25 U3.10
M2_LIN2: length 3
  Top Layer w0.254: U4.2 7.82,55.12 8.44,55.75 U3.9
M2_LIN3: length 3
  Top Layer w0.254: U3.8 8.38,56.25 7.75,55.62 U4.3
M2_LO1: length 9.8
  Top Layer w0.254: v1(3.5,58.5) 3.58,58.42 U4.11
  Inner1 w0.254: v1(3.5,58.5) 3.5,51.08 v1(4.08,50.5)
  Bottom Layer w0.254: v1(4.08,50.5) 3.28,50.5
M2_LO2: length 14.2
  Top Layer w0.254: U4.10 4.08,58.4 v1(4.17,58.49)
  Inner1 w0.254: v1(9.2,52.1) 9.2,50.62 v1(9.08,50.5)
  Inner2 w0.254: v1(4.17,58.49) 4.17,57.83 4.5,57.5 8.8,57.5 9.2,57.1 v1(9.2,52.1)
  Bottom Layer w0.254: v1(9.08,50.5) 8.28,50.5
M2_LO3: length 18.3
  Top Layer w0.254: v1(5.3,58.5) 4.9,58.5 4.58,58.18 U4.9
  Inner2 w0.254: v1(14.08,50.5) 14.1,50.53 14.1,51.3 13.7,51.7 13.7,58 13.2,58.5 v1(5.3,58.5)
  Bottom Layer w0.254: v1(14.08,50.5) 13.28,50.5
M2_VB1: length 5.1
  Top Layer w0.254: D4.1 3.3,52.7 3.58,52.98 ; 3.58,52.98 3.96,52.6 v1(4.52,52.6) ; 3.58,52.98 U4.20
  Inner1 w0.254: v1(4.52,52.6) 4.62,52.7 v1(6.65,52.7)
M2_VB2: length 4
  Top Layer w0.254: U4.17 1.04,55.12 v1(0.92,55.25)
  Inner1 w0.254: v1(0.92,57.7) v1(0.92,55.25)
M2_VB3: length 7.7
  Top Layer w0.254: D6.1 2.81,59.8 v1(2.8,59.8) 4.8,59.8 5.25,59.34 C10.2 ; U4.14 1.96,56.62 1.7,56.89 v1(1.7,57.1)
  Inner1 w0.254: v1(1.7,57.1) 1.8,57.1 2.2,57.5 2.2,59.2 v1(2.8,59.8)
M2_VS1: length 33.5
  Top Layer w0.254: U4.18 1.72,54.62 v1(1.6,54.5) ; C6.1 v1(5.56,52.1)
  Inner1 w0.254: v1(14.41,57.14) 14.16,57.4 4.2,57.4 3.86,57.06 3.86,52.34 4.2,52 5.46,52 v1(5.56,52.1) 5.56,49.04 5.17,48.65 v1(4.08,48.65) 1.97,48.65 1.6,49.03 v1(1.6,54.5)
  Bottom Layer w0.254: v1(4.08,48.65) Q19.9
  vias: v1(1.3,46) v1(1.3,45.5) v1(1.3,45) v1(1.3,44.5) v1(1.3,44) v1(1.8,46) v1(1.8,45.5) v1(1.8,45) v1(1.8,44.5) v1(1.8,44) v1(2.3,46) v1(2.3,45.5) v1(2.3,45) v1(2.3,44.5) v1(2.3,44) v1(2.8,46) v1(2.8,45.5) v1(2.8,45) v1(2.8,44.5) v1(2.8,44) v1(3.3,46) v1(3.3,45.5) v1(3.3,45) v1(3.3,44.5) v1(3.3,44)
M2_VS2: length 28.4
  Top Layer w0.254: U4.15 1.91,56.12 1.69,56.35 v1(1.5,56.35) 1.24,56.61 C7.1 ; R14.2 12.59,52.6 v1(12.59,52.1)
  Inner1 w0.254: v1(12.59,52.1) 12.59,51.8 12.2,51.4 10.2,51.4 9.9,51.1 9.9,49 9.55,48.65 v1(9.08,48.65) ; v1(4.08,49.3) 3.5,49.3 3.14,49.66 3.14,56.06 2.85,56.35 v1(1.5,56.35)
  Inner2 w0.254: v1(9.08,48.65) 9.38,48.65 9.58,48.45 9.58,47.29 9.28,47 8.87,47 8.57,47.29 8.57,47.93 7.2,49.3 v1(4.08,49.3)
  Bottom Layer w0.254: v1(9.08,48.65) Q20.9
  vias: v1(6.3,46) v1(6.3,45.5) v1(6.3,45) v1(6.3,44.5) v1(6.3,44) v1(6.8,46) v1(6.8,45.5) v1(6.8,45) v1(6.8,44.5) v1(6.8,44) v1(7.3,46) v1(7.3,45.5) v1(7.3,45) v1(7.3,44.5) v1(7.3,44) v1(7.8,46) v1(7.8,45.5) v1(7.8,45) v1(7.8,44.5) v1(7.8,44) v1(8.3,46) v1(8.3,45.5) v1(8.3,45) v1(8.3,44.5) v1(8.3,44)
M2_VS3: length 26.2
  Top Layer w0.254: v1(2.8,58.5) 2.8,58.25 3.08,57.97 U4.12
  Inner1 w0.254: v1(14.41,54.09) 14.77,53.74 14.77,48.98 14.43,48.65 v1(14.08,48.65) ; v1(2.8,58.5) 2.8,58.76 3.22,59.17 v1(4.17,59.17)
  Inner2 w0.254: v1(14.41,54.09) 14.92,54.6 14.92,58.67 14.46,59.13 4.21,59.13 v1(4.17,59.17)
  Bottom Layer w0.254: v1(14.08,48.65) Q21.9
  vias: v1(11.3,46) v1(11.3,45.5) v1(11.3,45) v1(11.3,44.5) v1(11.3,44) v1(11.8,46) v1(11.8,45.5) v1(11.8,45) v1(11.8,44.5) v1(11.8,44) v1(12.3,46) v1(12.3,45.5) v1(12.3,45) v1(12.3,44.5) v1(12.3,44) v1(12.8,46) v1(12.8,45.5) v1(12.8,45) v1(12.8,44.5) v1(12.8,44) v1(13.3,46) v1(13.3,45.5) v1(13.3,45) v1(13.3,44.5) v1(13.3,44)
M3_AIN: length 5
  Top Layer w0.254: U5.2 4.16,62.02 3.93,61.8 1.82,61.8 R27.2 ; R27.2 R31.2 ; R27.2 R24.1
M3_BIN: length 9.3
  Top Layer w0.254: U5.20 2.95,63.25 v1(2.88,63.17) ; v1(4.74,67.3) v1(3.7,67.3)
  Inner1 w0.254: v1(4.74,67.3) 4.89,67.3 5.4,66.8 5.81,66.8 6.32,67.3 v1(7.51,67.3) ; v1(3.7,67.3) 3.7,64 v1(2.88,63.17)
M3_C: length 13.2
  Top Layer w0.254: U5.19 2.6,63.75 v1(2.58,63.77)
  Inner1 w0.254: v1(0.92,61.84) 0.41,62.34 0.41,64.39 v1(0.92,64.89) 2.04,63.77 v1(2.58,63.77) 2.58,66.95 3.44,67.81 5.1,67.81 v1(5.61,67.3)
M3_C2CK: length 3.3
  Top Layer w0.254: U12.1 7.32,60.83 R29.2 6.1,61.27 5.66,61.72 U5.5
M3_C2D: length 3.8
  Top Layer w0.254: U17.1 7.89,61.52 6.5,61.52 6.16,61.87 U5.6
M3_CIN: length 4.6
  Top Layer w0.254: R26.1 R30.2 R33.2 1.78,63.85 2.35,63.28 2.35,62.92 2.65,62.62 U5.1
M3_HIN1: length 9
  Top Layer w0.254: U5.14 4.66,66.27 v1(4.23,66.7) ; U6.22 10.75,66.66 v1(10.81,66.72)
  Inner1 w0.254: v1(4.23,66.7) 4.53,66.4 10.49,66.4 v1(10.81,66.72)
M3_HIN2: length 6.5
  Top Layer w0.254: U6.23 10.25,66.54 10.06,66.73 9.46,66.73 8.88,66.15 5.33,66.15 5.16,65.98 U5.13
M3_HIN3: length 3.9
  Top Layer w0.254: U6.24 9.51,65.8 7.34,65.8 6.92,65.38 U5.11
M3_HO1: length 10.4
  Top Layer w0.254: U6.19 12.31,66.1 v1(13.08,66.1) ; v1(10.52,72.5) Q4.4
  Inner2 w0.254: v1(13.08,66.1) 13.08,72.12 12.7,72.5 v1(10.52,72.5)
M3_HO2: length 17.4
  Top Layer w0.254: v1(5.52,72.5) Q5.4 ; v1(13.83,64.3) 13.75,64.38 U6.16
  Inner2 w0.254: v1(5.52,72.5) 6.7,72.5 7.03,72.17 7.03,69.2 7.43,68.8 12.03,68.8 12.57,68.26 12.57,64.55 12.83,64.3 v1(13.83,64.3)
M3_HO3: length 24.6
  Top Layer w0.254: U6.13 12.93,62.86 12.93,62.5 13.23,62.2 v1(13.63,62.2) ; v1(0.52,72.5) Q6.4
  Inner2 w0.254: v1(13.63,62.2) 12.58,62.2 12.22,62.56 12.22,68.11 11.88,68.44 2.28,68.44 1.93,68.8 1.93,72.17 1.6,72.5 v1(0.52,72.5)
M3_LIN1: length 3
  Top Layer w0.254: U6.1 7.43,65.38 6.81,64.75 U5.10
M3_LIN2: length 3
  Top Layer w0.254: U6.2 7.51,64.88 6.89,64.25 U5.9
M3_LIN3: length 3
  Top Layer w0.254: U6.3 7.58,64.38 6.95,63.75 U5.8
M3_LO1: length 10.5
  Top Layer w0.254: v1(11.83,61.5) 11.75,61.58 U6.11
  Inner1 w0.254: v1(11.83,61.5) 11.83,68.92 11.25,69.5 v1(10.52,69.5)
  Bottom Layer w0.254: v1(10.52,69.5) Q10.4
M3_LO2: length 14.5
  Top Layer w0.254: U6.10 11.25,61.6 v1(11.16,61.51)
  Inner1 w0.254: v1(6.13,67.9) 6.13,69.17 5.8,69.5 v1(5.53,69.5)
  Inner2 w0.254: v1(6.13,67.9) 6.13,62.9 6.53,62.5 10.83,62.5 11.16,62.17 v1(11.16,61.51)
  Bottom Layer w0.254: v1(5.52,69.5) Q11.4
M3_LO3: length 19
  Top Layer w0.254: U6.9 10.75,61.82 10.43,61.5 v1(10.03,61.5)
  Inner2 w0.254: v1(10.03,61.5) 2.13,61.5 1.63,62 1.63,68.41 1.38,68.67 1.38,69.22 1.1,69.5 v1(0.53,69.5)
  Bottom Layer w0.254: v1(0.52,69.5) Q12.4
M3_PWM: length 1.1
  Top Layer w0.254: 0.92,66.92 0.92,67.72 v1(1.1,67.9)
M3_VB1: length 5.1
  Top Layer w0.254: D7.1 12.03,67.3 11.75,67.02 ; 11.75,67.02 11.37,67.4 v1(10.81,67.4) ; 11.75,67.02 U6.20
  Inner1 w0.254: v1(8.68,67.3) 10.71,67.3 v1(10.81,67.4)
M3_VB2: length 4
  Top Layer w0.254: U6.17 14.29,64.88 v1(14.41,64.75)
  Inner1 w0.254: v1(14.41,62.3) v1(14.41,64.75)
M3_VB3: length 7.7
  Top Layer w0.254: v1(13.63,62.9) 13.63,63.11 13.37,63.38 U6.14 ; C15.2 10.07,60.66 10.53,60.2 v1(12.53,60.2) 12.52,60.2 D9.1
  Inner1 w0.254: v1(12.53,60.2) 13.12,60.8 13.12,62.5 13.53,62.9 v1(13.63,62.9)
M3_VS1: length 33.5
  Top Layer w0.254: C11.1 v1(9.77,67.9) ; v1(13.73,65.5) 13.61,65.38 U6.18
  Inner1 w0.254: v1(0.92,62.86) 1.17,62.6 11.13,62.6 11.47,62.94 11.47,67.66 11.13,68 9.86,68 v1(9.77,67.9) 9.77,70.96 10.15,71.35 v1(10.53,71.35) 13.35,71.35 13.73,70.97 v1(13.73,65.5)
  Bottom Layer w0.254: v1(10.53,71.35) Q10.9
  vias: v1(11.3,76) v1(11.3,75.5) v1(11.3,75) v1(11.3,74.5) v1(11.3,74) v1(11.8,76) v1(11.8,75.5) v1(11.8,75) v1(11.8,74.5) v1(11.8,74) v1(12.3,76) v1(12.3,75.5) v1(12.3,75) v1(12.3,74.5) v1(12.3,74) v1(12.8,76) v1(12.8,75.5) v1(12.8,75) v1(12.8,74.5) v1(12.8,74) v1(13.3,76) v1(13.3,75.5) v1(13.3,75) v1(13.3,74.5) v1(13.3,74)
M3_VS2: length 28.8
  Top Layer w0.254: C12.1 14.09,63.39 v1(13.83,63.65) 13.64,63.65 13.42,63.88 U6.15 ; v1(2.73,67.9) 2.73,67.4 R25.2
  Inner1 w0.254: v1(5.53,71.35) 5.27,71.35 5.02,71.1 5.02,68.92 4.7,68.6 3.13,68.6 2.73,68.2 v1(2.73,67.9) ; v1(13.83,63.65) 12.48,63.65 12.19,63.94 12.19,70.34 11.83,70.7 v1(10.53,70.7)
  Inner2 w0.254: v1(5.53,71.35) 5.33,71.35 5.02,71.65 5.02,72.71 5.32,73 6.7,73 7.38,72.32 7.38,71.05 7.74,70.7 v1(10.53,70.7)
  Bottom Layer w0.254: v1(5.53,71.35) Q11.9
  vias: v1(6.3,76) v1(6.3,75.5) v1(6.3,75) v1(6.3,74.5) v1(6.3,74) v1(6.8,76) v1(6.8,75.5) v1(6.8,75) v1(6.8,74.5) v1(6.8,74) v1(7.3,76) v1(7.3,75.5) v1(7.3,75) v1(7.3,74.5) v1(7.3,74) v1(7.8,76) v1(7.8,75.5) v1(7.8,75) v1(7.8,74.5) v1(7.8,74) v1(8.3,76) v1(8.3,75.5) v1(8.3,75) v1(8.3,74.5) v1(8.3,74)
M3_VS3: length 26.4
  Top Layer w0.254: v1(12.53,61.5) 12.53,61.75 12.25,62.03 U6.12
  Inner1 w0.254: v1(0.53,71.35) 0.83,71.35 1.1,71.08 1.1,69.36 0.56,68.83 0.56,66.26 v1(0.92,65.91) ; v1(12.53,61.5) 12.53,61.24 12.11,60.83 v1(11.16,60.83)
  Inner2 w0.254: v1(0.92,65.91) 0.41,65.4 0.41,61.33 0.86,60.87 11.12,60.87 v1(11.16,60.83)
  Bottom Layer w0.254: v1(0.53,71.35) Q12.9
  vias: v1(1.3,76) v1(1.3,75.5) v1(1.3,75) v1(1.3,74.5) v1(1.3,74) v1(1.8,76) v1(1.8,75.5) v1(1.8,75) v1(1.8,74.5) v1(1.8,74) v1(2.3,76) v1(2.3,75.5) v1(2.3,75) v1(2.3,74.5) v1(2.3,74) v1(2.8,76) v1(2.8,75.5) v1(2.8,75) v1(2.8,74.5) v1(2.8,74) v1(3.3,76) v1(3.3,75.5) v1(3.3,75) v1(3.3,74.5) v1(3.3,74)
M4_AIN: length 5
  Top Layer w0.254: U7.2 93.84,57.98 94.07,58.2 96.18,58.2 R38.2 ; R38.2 R35.1 ; R38.2 R42.2
M4_BIN: length 9.3
  Top Layer w0.254: v1(95.12,56.83) 95.05,56.75 U7.20 ; v1(93.26,52.7) v1(94.3,52.7)
  Inner1 w0.254: v1(94.3,52.7) 94.3,56 v1(95.12,56.83) ; v1(90.49,52.7) 91.68,52.7 92.19,53.2 92.6,53.2 93.11,52.7 v1(93.26,52.7)
M4_C: length 13.2
  Top Layer w0.254: U7.19 95.4,56.25 v1(95.42,56.23)
  Inner1 w0.254: v1(97.09,58.16) 97.59,57.66 97.59,55.61 v1(97.09,55.11) 95.96,56.23 v1(95.42,56.23) 95.42,53.05 94.56,52.19 92.9,52.19 v1(92.39,52.7)
M4_C2CK: length 3.3
  Top Layer w0.254: U7.5 92.34,58.28 91.9,58.73 R40.2 90.68,59.17 U13.1
M4_C2D: length 3.8
  Top Layer w0.254: U7.6 91.84,58.13 91.5,58.48 90.11,58.48 U18.1
M4_CIN: length 4.6
  Top Layer w0.254: R37.1 R41.2 96.22,56.15 95.65,56.72 95.65,57.08 95.35,57.38 U7.1
M4_HIN1: length 9
  Top Layer w0.254: v1(87.19,53.28) 87.25,53.34 U8.22 ; v1(93.77,53.3) 93.34,53.73 U7.14
  Inner1 w0.254: v1(93.77,53.3) 93.47,53.6 87.51,53.6 v1(87.19,53.28)
M4_HIN2: length 6.5
  Top Layer w0.254: U7.13 92.84,54.02 92.67,53.85 89.12,53.85 88.54,53.27 87.94,53.27 87.75,53.46 U8.23
M4_HIN3: length 3.9
  Top Layer w0.254: U7.11 91.07,54.62 90.66,54.2 88.49,54.2 U8.24
M4_HO1: length 10.4
  Top Layer w0.254: v1(84.92,53.9) 85.69,53.9 U8.19 ; v1(87.48,47.5) 86.68,47.5
  Inner2 w0.254: v1(84.92,53.9) 84.92,47.88 85.3,47.5 v1(87.48,47.5)
M4_HO2: length 17.4
  Top Layer w0.254: v1(92.48,47.5) 91.68,47.5 ; U8.16 84.25,55.62 v1(84.17,55.7)
  Inner2 w0.254: v1(92.48,47.5) 91.3,47.5 90.97,47.83 90.97,50.8 90.57,51.2 85.97,51.2 85.43,51.74 85.43,55.45 85.17,55.7 v1(84.17,55.7)
M4_HO3: length 24.6
  Top Layer w0.254: v1(84.37,57.8) 84.77,57.8 85.07,57.5 85.07,57.14 U8.13 ; v1(97.48,47.5) 96.68,47.5
  Inner2 w0.254: v1(84.37,57.8) 85.42,57.8 85.78,57.44 85.78,51.89 86.12,51.56 95.72,51.56 96.07,51.2 96.07,47.83 96.4,47.5 v1(97.48,47.5)
M4_LIN1: length 3
  Top Layer w0.254: U7.10 91.19,55.25 90.57,54.62 U8.1
M4_LIN2: length 3
  Top Layer w0.254: U8.2 90.49,55.12 91.11,55.75 U7.9
M4_LIN3: length 3
  Top Layer w0.254: U7.8 91.05,56.25 90.42,55.62 U8.3
M4_LO1: length 10.5
  Top Layer w0.254: v1(86.17,58.5) 86.25,58.42 U8.11
  Inner1 w0.254: v1(87.48,50.5) 86.75,50.5 86.17,51.08 v1(86.17,58.5)
  Bottom Layer w0.254: v1(87.48,50.5) 86.68,50.5
M4_LO2: length 14.5
  Top Layer w0.254: U8.10 86.75,58.4 v1(86.84,58.49)
  Inner1 w0.254: v1(91.87,52.1) 91.87,50.83 92.2,50.5 v1(92.47,50.5)
  Inner2 w0.254: v1(91.87,52.1) 91.87,57.1 91.47,57.5 87.17,57.5 86.84,57.83 v1(86.84,58.49)
  Bottom Layer w0.254: v1(92.48,50.5) 91.68,50.5
M4_LO3: length 19
  Top Layer w0.254: v1(87.97,58.5) 87.57,58.5 87.25,58.18 U8.9
  Inner2 w0.254: v1(87.97,58.5) 95.87,58.5 96.37,58 96.37,51.59 96.62,51.33 96.62,50.78 96.9,50.5 v1(97.47,50.5)
  Bottom Layer w0.254: v1(97.48,50.5) 96.68,50.5
M4_PWM: length 1.1
  Top Layer w0.254: v1(96.9,52.1) 97.09,52.28 R34.2
M4_VB1: length 5.1
  Top Layer w0.254: v1(87.19,52.6) 86.63,52.6 86.25,52.98 ; D10.1 85.97,52.7 86.25,52.98 ; 86.25,52.98 U8.20
  Inner1 w0.254: v1(87.19,52.6) 87.29,52.7 v1(89.32,52.7)
M4_VB2: length 4
  Top Layer w0.254: v1(83.59,55.25) 83.71,55.12 U8.17
  Inner1 w0.254: v1(83.59,57.7) v1(83.59,55.25)
M4_VB3: length 7.7
  Top Layer w0.254: v1(84.37,57.1) 84.37,56.89 84.63,56.62 U8.14 ; C20.2 87.93,59.34 87.47,59.8 v1(85.47,59.8) 85.48,59.8 D12.1
  Inner1 w0.254: v1(85.47,59.8) 84.88,59.2 84.88,57.5 84.47,57.1 v1(84.37,57.1)
M4_VS1: length 33.5
  Top Layer w0.254: U8.18 84.39,54.62 v1(84.27,54.5) ; C16.1 v1(88.23,52.1)
  Inner1 w0.254: v1(84.27,54.5) 84.27,49.03 84.65,48.65 v1(87.47,48.65) 87.85,48.65 88.23,49.04 v1(88.23,52.1) 88.13,52 86.87,52 86.53,52.34 86.53,57.06 86.87,57.4 96.83,57.4 v1(97.09,57.14)
  Bottom Layer w0.254: v1(87.47,48.65) Q22.9
  vias: v1(84.7,46) v1(84.7,45.5) v1(84.7,45) v1(84.7,44.5) v1(84.7,44) v1(85.2,46) v1(85.2,45.5) v1(85.2,45) v1(85.2,44.5) v1(85.2,44) v1(85.7,46) v1(85.7,45.5) v1(85.7,45) v1(85.7,44.5) v1(85.7,44) v1(86.2,46) v1(86.2,45.5) v1(86.2,45) v1(86.2,44.5) v1(86.2,44) v1(86.7,46) v1(86.7,45.5) v1(86.7,45) v1(86.7,44.5) v1(86.7,44)
M4_VS2: length 28.8
  Top Layer w0.254: v1(95.26,52.1) 95.26,52.6 R36.2 ; U8.15 84.58,56.12 84.36,56.35 v1(84.17,56.35) 83.91,56.61 83.59,56.61
  Inner1 w0.254: v1(95.26,52.1) 95.26,51.8 94.87,51.4 93.3,51.4 92.98,51.08 92.98,48.9 92.73,48.65 v1(92.47,48.65) ; v1(87.47,49.3) 86.17,49.3 85.81,49.66 85.81,56.06 85.52,56.35 v1(84.17,56.35)
  Inner2 w0.254: v1(87.47,49.3) 90.26,49.3 90.62,48.95 90.62,47.68 91.3,47 92.68,47 92.98,47.29 92.98,48.35 92.68,48.65 v1(92.47,48.65)
  Bottom Layer w0.254: v1(92.47,48.65) Q23.9
  vias: v1(89.7,46) v1(89.7,45.5) v1(89.7,45) v1(89.7,44.5) v1(89.7,44) v1(90.2,46) v1(90.2,45.5) v1(90.2,45) v1(90.2,44.5) v1(90.2,44) v1(90.7,46) v1(90.7,45.5) v1(90.7,45) v1(90.7,44.5) v1(90.7,44) v1(91.2,46) v1(91.2,45.5) v1(91.2,45) v1(91.2,44.5) v1(91.2,44) v1(91.7,46) v1(91.7,45.5) v1(91.7,45) v1(91.7,44.5) v1(91.7,44)
M4_VS3: length 26.4
  Top Layer w0.254: U8.12 85.75,57.97 85.47,58.25 v1(85.47,58.5)
  Inner1 w0.254: v1(97.09,54.09) 97.44,53.74 97.44,51.17 96.9,50.64 96.9,48.92 97.18,48.65 v1(97.47,48.65) ; v1(86.84,59.17) 85.89,59.17 85.47,58.76 v1(85.47,58.5)
  Inner2 w0.254: v1(86.84,59.17) 86.88,59.13 97.13,59.13 97.59,58.67 97.59,54.6 v1(97.09,54.09)
  Bottom Layer w0.254: v1(97.47,48.65) Q24.9
  vias: v1(94.7,46) v1(94.7,45.5) v1(94.7,45) v1(94.7,44.5) v1(94.7,44) v1(95.2,46) v1(95.2,45.5) v1(95.2,45) v1(95.2,44.5) v1(95.2,44) v1(95.7,46) v1(95.7,45.5) v1(95.7,45) v1(95.7,44.5) v1(95.7,44) v1(96.2,46) v1(96.2,45.5) v1(96.2,45) v1(96.2,44.5) v1(96.2,44) v1(96.7,46) v1(96.7,45.5) v1(96.7,45) v1(96.7,44.5) v1(96.7,44)
$1N9645: length 3.7
  Top Layer w0.254: U1.18 85.6,64.25 85.1,64.75 85.1,66.27 R1.1
$1N9747: length 3.7
  Top Layer w0.254: U3.18 12.4,55.75 12.9,55.25 12.9,53.73 R12.1
$1N9849: length 3.7
  Top Layer w0.254: U5.18 2.93,64.25 2.43,64.75 2.43,66.27 R23.1
$1N9951: length 3.7
  Top Layer w0.254: U7.18 95.07,55.75 95.57,55.25 95.57,53.73 R34.1

## Copper pours and planes (outline as drawn; the poured copper is in the pictures)
M1_VS1 on Top Layer: 94.4,76.3 97,76.3 97,72.1 94.4,72.1
M1_VS1 on Bottom Layer: 94.4,76.3 97,76.3 97,70.3 94.4,70.3
M1_VS2 on Top Layer: 89.4,76.3 92,76.3 92,72.1 89.4,72.1
M1_VS2 on Bottom Layer: 89.4,76.3 92,76.3 92,70.3 89.4,70.3
M1_VS3 on Top Layer: 84.4,76.3 87,76.3 87,72.1 84.4,72.1
M1_VS3 on Bottom Layer: 84.4,76.3 87,76.3 87,70.3 84.4,70.3
M2_VS1 on Top Layer: 1,47.9 3.6,47.9 3.6,43.7 1,43.7
M2_VS1 on Bottom Layer: 1,49.7 3.6,49.7 3.6,43.7 1,43.7
M2_VS2 on Top Layer: 6,47.9 8.6,47.9 8.6,43.7 6,43.7
M2_VS2 on Bottom Layer: 6,49.7 8.6,49.7 8.6,43.7 6,43.7
M2_VS3 on Top Layer: 11,47.9 13.6,47.9 13.6,43.7 11,43.7
M2_VS3 on Bottom Layer: 11,49.7 13.6,49.7 13.6,43.7 11,43.7
M3_VS1 on Top Layer: 11,76.3 13.6,76.3 13.6,72.1 11,72.1
M3_VS1 on Bottom Layer: 11,76.3 13.6,76.3 13.6,70.3 11,70.3
M3_VS2 on Top Layer: 6,76.3 8.6,76.3 8.6,72.1 6,72.1
M3_VS2 on Bottom Layer: 6,76.3 8.6,76.3 8.6,70.3 6,70.3
M3_VS3 on Top Layer: 1,76.3 3.6,76.3 3.6,72.1 1,72.1
M3_VS3 on Bottom Layer: 1,76.3 3.6,76.3 3.6,70.3 1,70.3
M4_VS1 on Top Layer: 84.4,47.9 87,47.9 87,43.7 84.4,43.7
M4_VS1 on Bottom Layer: 84.4,49.7 87,49.7 87,43.7 84.4,43.7
M4_VS2 on Top Layer: 89.4,47.9 92,47.9 92,43.7 89.4,43.7
M4_VS2 on Bottom Layer: 89.4,49.7 92,49.7 92,43.7 89.4,43.7
M4_VS3 on Top Layer: 94.4,47.9 97,47.9 97,43.7 94.4,43.7
M4_VS3 on Bottom Layer: 94.4,49.7 97,49.7 97,43.7 94.4,43.7
